# Altium project Temprature_And_Humidity_Controller.PrjPcb
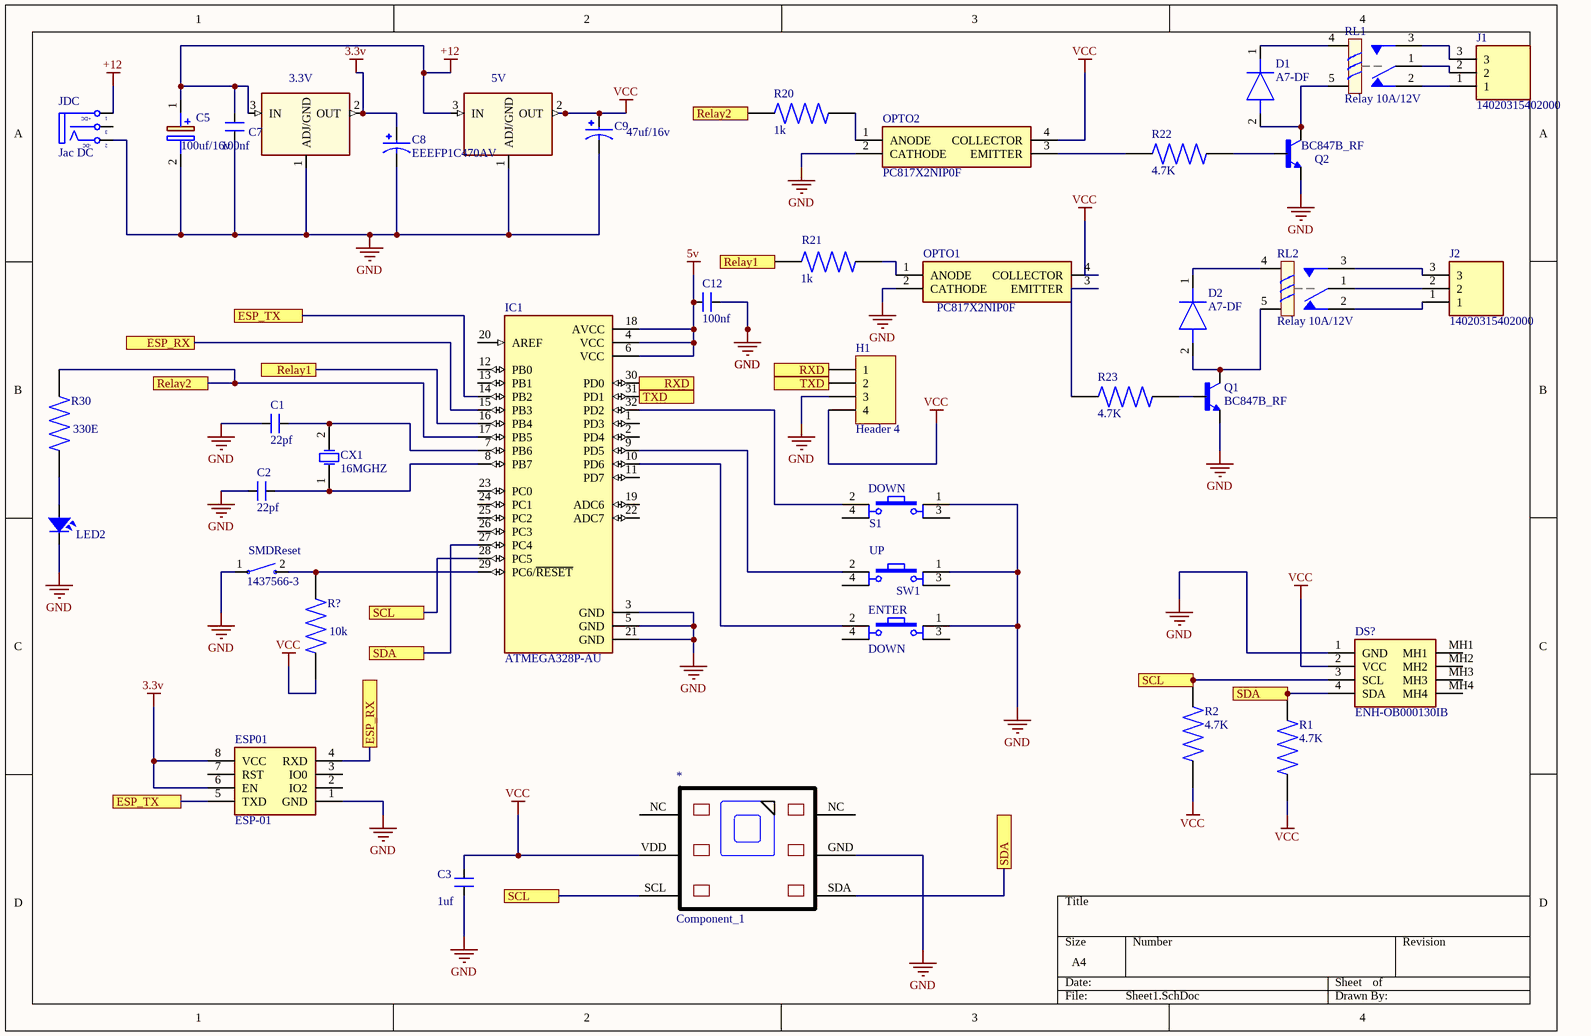
[diagram p0: Sheet1.SchDoc]
1 sheet, 40 parts. Net scope: flat (ports and power ports of the same name join across sheets).
Board file: PCB1.PcbDoc

## Sheet Sheet1.SchDoc
size A4

### Parts
3.3V  LM1117MP-3.3TR  [SOT-223 3-Lead]  (value not drawn)
5V  LM1117MP-3.3TR  [SOT-223 3-Lead]  (value not drawn)
*  Component_1  [PCBComponent_1]
C1  22pf  [SM-0805]
C2  22pf  [SM-0805]
C3  1uf  [SM-0805]
C5  100uf/16v  [CAPAE660X570N]
C7  100nf  [SM-0805]
C8  EEEFP1C470AV  [CAP_EEEFP1C470AV]
C9  47uf/16v  [CAP_EEEFP1C470AV]
C12  100nf  [SM-0805]
CX1  16MGHZ  [CSM-7]
D1  A7-DF  [SODFL3717X133N]
D2  A7-DF  [SODFL3717X133N]
DOWN  S1  [SW4]
DS?  ENH-OB000130IB  [ENHOB000130IB]
ENTER  DOWN  [SW4]
ESP01  ESP-01  [ESP01]
H1  Header 4  [HDR1X4]
IC1  ATMEGA328P-AU  [QFP80P900X900X120-32N]
J1  14020315402000  [14020315402000]
J2  14020315402000  [14020315402000]
JDC  Jac DC  [DC-IN]
LED2  LED SMD  [SM-LED-1206-Blue]  (value not drawn)
OPTO1  PC817X2NIP0F  [SOP254P975X460-4N]
OPTO2  PC817X2NIP0F  [SOP254P975X460-4N]
Q1  BC847B_RF  [SOT95P237X112-3N]
Q2  BC847B_RF  [SOT95P237X112-3N]
R1  4.7K  [RES_ERA8APB6981V]
R2  4.7K  [RES_ERA8APB6981V]
R20  1k  [RES_ERA8APB6981V]
R21  1k  [RES_ERA8APB6981V]
R22  4.7K  [RES_ERA8APB6981V]
R23  4.7K  [RES_ERA8APB6981V]
R30  330E  [RES_ERA8APB6981V]
R?  10k  [RES_ERA8APB6981V]
RL1  Relay 10A/12V  [RL_SPDT_10A]
RL2  Relay 10A/12V  [RL_SPDT_10A]
SMDReset  1437566-3  [SW_1437566-3]
UP  SW1  [SW4]

### Ports
ESP_RX, ESP_TX, Relay1, Relay2, RXD, SCL, SDA, TXD

### Nets
3.3v: 3.3V.2(OUT) C8.1 ESP01.6(EN) ESP01.8(VCC)
5v: C12.2 IC1.4(VCC) IC1.6(VCC) IC1.18(AVCC)
+12: 3.3V.3(IN) 5V.3(IN) C5.1(+) C7.2 JDC.1(T)
GND: 3.3V.1(ADJ/GND) 5V.1(ADJ/GND) *.GND C1.1 C2.1 C3.1 C5.2(-) C7.1 C8.2 C9.2 C12.1 DOWN.1 DS?.1(GND) ENTER.1 ESP01.1(GND) H1.3 IC1.3(GND) IC1.5(GND) IC1.21(GND) JDC.2(TN) LED2.2 OPTO1.2(CATHODE) OPTO2.2(CATHODE) Q1.2(E) Q2.2(E) SMDReset.1 UP.1
VCC: 5V.2(OUT) *.VDD C3.2 C9.1 DS?.2(VCC) H1.4 OPTO1.4(COLLECTOR) OPTO2.4(COLLECTOR) R1.1 R2.1 R?.2
Net*_SCL: *.SCL DS?.3(SCL) IC1.28(PC5) R2.2 ; port SCL
Net*_SDA: *.SDA DS?.4(SDA) IC1.27(PC4) R1.2 ; port SDA
NetC1_2: C1.2 CX1.2(OSC2) IC1.7(PB6)
NetC2_2: C2.2 CX1.1(OSC1) IC1.8(PB7)
NetD1_1: D1.1(K) RL1.4
NetD1_2: D1.2(A) Q2.3(C) RL1.5
NetD2_1: D2.1(K) RL2.4
NetD2_2: D2.2(A) Q1.3(C) RL2.5
NetDOWN_2: DOWN.2 IC1.32(PD2)
NetENTER_2: ENTER.2 IC1.10(PD6)
NetESP01_4: ESP01.4(RXD) IC1.15(PB3) ; port ESP_RX
NetESP01_5: ESP01.5(TXD) IC1.14(PB2) ; port ESP_TX
NetH1_1: H1.1 IC1.30(PD0) ; port RXD
NetH1_2: H1.2 IC1.31(PD1) ; port TXD
NetIC1_9: IC1.9(PD5) UP.2
NetIC1_16: IC1.16(PB4) R21.2 ; port Relay1
NetIC1_17: IC1.17(PB5) R20.2 R30.1 ; port Relay2
NetIC1_29: IC1.29(PC6/~{RESET}) R?.1 SMDReset.2
NetJ1_1: J1.1 RL1.2
NetJ1_2: J1.2 RL1.1
NetJ1_3: J1.3 RL1.3
NetJ2_1: J2.1 RL2.2
NetJ2_2: J2.2 RL2.1
NetJ2_3: J2.3 RL2.3
NetLED2_1: LED2.1 R30.2
NetOPTO1_1: OPTO1.1(ANODE) R21.1
NetOPTO1_3: OPTO1.3(EMITTER) R23.2
NetOPTO2_1: OPTO2.1(ANODE) R20.1
NetOPTO2_3: OPTO2.3(EMITTER) R22.2
NetQ1_1: Q1.1(B) R23.1
NetQ2_1: Q2.1(B) R22.1

Not connected (* = marked no-connect by the designer): * NC; DOWN 3 4; DS? MH1 MH2 MH3 MH4; ENTER 3 4; ESP01 2(IO2) 3(IO0) 7(RST); IC1 1(PD3) 2(PD4) 11(PD7) 12(PB0) 13(PB1) 19(ADC6) 20(AREF) 22(ADC7) 23(PC0) 24(PC1) 25(PC2) 26(PC3); JDC 3(S); UP 3 4

### Notes on the sheet
- (in symbol DCIN) +DC; -DC

### Library data of the parts
3.3V 5V = LM1117MP-3.3TR: 3.3V 800mA Low-Dropout Linear Regulator; PSpiceTemplate: X^@REFDES %IN %OUT %GND @MODEL; Vendor: Digikey; Volt (Max): 20V; Publisher: Hoang Nguyen; ComponentLink1URL: http://search.digikey.com/scripts/DkSearch/dksus.dll?Detail&name=LM1117MP-3.3TR-ND; ComponentLink1Description: Digikey Part Link; ComponentLink2Description: Open Datasheet; ComponentLink2URL: H:\LIBRARY\LIBRARY.Datasheet\LM1117.pdf; Published: 13-April-2009; V out: 3.3V; Output Current (max): 800mA; Price: 4.000 VND
C1-C3 C7 C12 = CM: Cap SMD; Value: 103
C5 = 107SML016M: Capacitor Polarised; Manufacturer_Name: Cornell Dubilier; Datasheet Link: https://www.cde.com/resources/catalogs/SML.pdf; Height: 5.7mm; Manufacturer_Part_Number: 107SML016M; Mouser Part Number: 598-107SML016M; Mouser Price/Stock: https://www.mouser.co.uk/ProductDetail/CDE-Illinois-Capacitor/107SML016M?qs=3tP%252BN51vMXcTATCBEHDSHw%3D%3D
C8 C9 = EEEFP1C470AV: CAP ALUM 47UF 20% 16V SMD; MF: Panasonic; Check_prices: https://www.snapeda.com/parts/EEEFP1C470AV/Panasonic/view-part/5790575/?ref=eda; SnapEDA_Link: https://www.snapeda.com/parts/EEEFP1C470AV/Panasonic/view-part/5790575/?ref=snap; Price: None; Availability: No availability data; Package: RADIAL-2 Panasonic; MP: EEEFP1C470AV; Value: *
CX1 = ECS-110-S-5P: Crystal Oscillator; Published: 17-Jul-2002; DatasheetDocument: 18-Apr-2000; PackageReference: CSM-7; Publisher: Altium Limited; ComponentLink1Description: Manufacturer Link; ComponentLink1URL: http://www.ecsxtal.com/; ComponentLink2Description: Datasheet; ComponentLink2URL: http://www.ecsxtal.com/pdf3/CSM_7.pdf
D1 D2 = A7-DF: Diode; Manufacturer_Name: Xx(Xingxin sci-tech); Datasheet Link: https://datasheet.lcsc.com/szlcsc/1912111437_Xx-Xingxin-sci-tech-A7-DF_C383633.pdf; Height: 1.33mm; Manufacturer_Part_Number: A7-DF
DOWN ENTER UP = SW4: Switch button 4 pin; Value: Button chip 4 pin
DS? = ENH-OB000130IB: Display; Manufacturer_Name: Enrich; Height: 4.4mm; Manufacturer_Part_Number: ENH-OB000130IB
ESP01 = ESP-01: Integrated Circuit; Manufacturer_Name: Ai-Thinker; Datasheet Link: https://docs.ai-thinker.com/_media/esp8266/docs/esp-01_product_specification_en.pdf; Manufacturer_Part_Number: ESP-01
H1 = Header 4: Header, 4-Pin; LatestRevisionDate: 17-Jul-2002; LatestRevisionNote: Re-released for DXP Platform.; Publisher: Altium Limited
IC1 = ATMEGA328P-AU: ATmega Series 20 MHz 32 KB Flash 2 KB SRAM 8-Bit Microcontroller - TQFP-32; Value: *; Availability: Unavailable; Price: None; Package: None; MP: ATMEGA328P-AU
J1 J2 = 14020315402000: Connector; Manufacturer_Name: HARTING; Datasheet Link: https://b2b.harting.com/files/download/PRD/PDF_TS/1402XX15402XXX_100529077DRW001D.pdf?showPrivacyEmailAgreement=false&contextURL=https%3A%2F%2Fb2b.harting.com%2Febusiness%2Fru&autoLogoutEnabled=false&autoLogoutTime=0&siteName=Ebusiness+Site; Height: 8.5mm; Manufacturer_Part_Number: 14020315402000; Mouser Part Number: 617-14020315402000; Mouser Price/Stock: https://www.mouser.co.uk/ProductDetail/HARTING/14020315402000?qs=byeeYqUIh0ODgUrquVW9%2FA%3D%3D
JDC = DCIN: Jac DC input; Value: Jac DC
LED2 = LED-SMD-1206
OPTO1 OPTO2 = PC817X2NIP0F: Integrated Circuit; Manufacturer_Name: Sharp Microelectronics; Datasheet Link: https://ew.componentsearchengine.com/Datasheets/2/PC817X2NIP0F.pdf; Height: 4.6mm; Manufacturer_Part_Number: PC817X2NIP0F; Mouser Part Number: N/A; Mouser Price/Stock: https://www.mouser.co.uk/ProductDetail/Sharp-Microelectronics/PC817X2NIP0F?qs=je7EQiYm86lhc4x%252BMeaZDQ%3D%3D
Q1 Q2 = BC847B_RF: SOT-23, 50V, 0.1A, NPN Bipolar TransistÃ¶r; MP: BC847B RF; MF: Taiwan Semiconductor; SnapEDA_Link: https://www.snapeda.com/parts/BC847B%20RF/Taiwan+Semiconductor/view-part/?ref=snap; Check_prices: https://www.snapeda.com/parts/BC847B%20RF/Taiwan+Semiconductor/view-part/?ref=eda; Availability: In Stock; Package: SOT-23-3 Taiwan Semiconductor; Price: None; Value: *; Purchase-URL: https://pricing.snapeda.com/search/part/BC847B RF/?ref=eda
R1 R2 R20-R23 R30 R? = ERA8APB6981V: Package: None; Availability: Unavailable; Value: *; MP: ERA8APB6981V; Price: None
RL1 RL2 = Relay 1: Relay SPDT,10A - 12VDC 5 Pin; Value: Relay SPDT, 10A, 12V
SMDReset = 1437566-3: Switch Tactile OFF (ON) SPST Rectangular Button Gull Wing 0.05A 12VDC SMD Loose Piece; Price: None; Value: *; Package: None; Availability: Unavailable; MP: 1437566-3